# EAGLE schematic RFM69HCW_BREAKOUT (EAGLE 7.7.0)
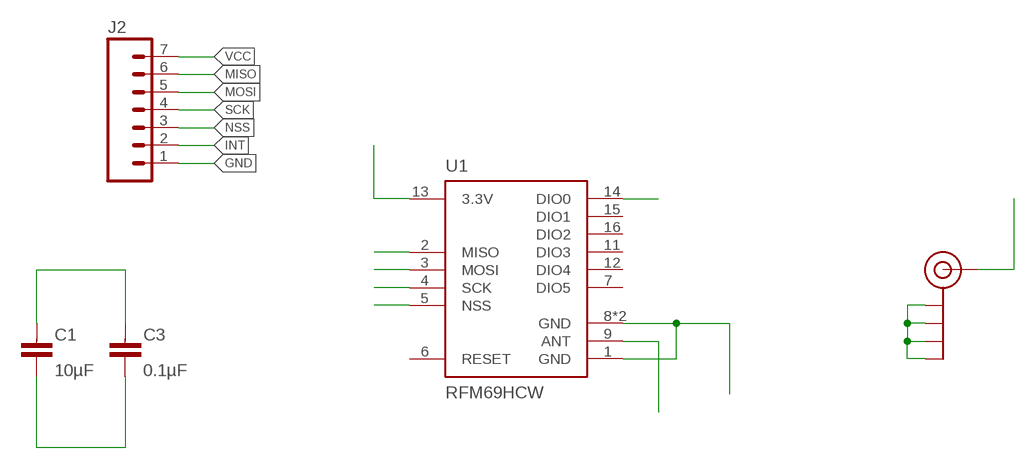
[diagram p0: schematic, sheet 1]

## Parts
C1  10µF  CAPACITOR0805-N  [C0805-N]
C3  0.1µF  CAPACITOR0603-N  [C0603-N]
J2  M07  [1X07]
J$1  SMA_EDGE  [SMA-EDGE]
U1  RFM69HCW  [RFM69HCW-XXXS2]

## Nets
ANT: J$1.SIG(SIGNAL) U1.9(ANT)
GND: C1.2 C3.2 J2.1 J$1.GND@0(GND) J$1.GND@1(GND) J$1.GND@2(GND) J$1.GND@3(GND) U1.1(GND) U1.8(GND) U1.10(GND)
INT: J2.2 U1.14(DIO0)
MISO: J2.6 U1.2(MISO)
MOSI: J2.5 U1.3(MOSI)
NSS: J2.3 U1.5(NSS)
SCK: J2.4 U1.4(SCK)
VCC: C1.1 C3.1 J2.7 U1.13(3.3V)
Unconnected: U1.6(RESET) U1.7(DIO5) U1.11(DIO3) U1.12(DIO4) U1.15(DIO1) U1.16(DIO2)

## Library data of the parts
C1 C3 = passives-7351:CAPACITOR
J2 = SparkFun-Connectors:M07: Header 7 Standard 7-pin 0.1" header. Use with straight break away headers (SKU : PRT-00116), right angle break away headers (PRT-00553), swiss pins (PRT-00743), machine pins (PRT-00117), and female headers (PRT-00115). NOTES ON THE VARIANTS LOCK and LOCK_LONGPADS... This footprint was designed to help hold the alignment of a through-hole component (i.e. 7-pin header) while soldering it into place. You may notice that each hole has been shifted either up or down by 0.005 of an inch from it's more standard position (which is usually a perfectly straight line). This slight alteration caused the pins (the squares in the middle) to touch the edges of the holes. Because they are alternating, it causes a "brace" to hold the header in place. 0.005 has proven to be the perfect amount of "off-center" position when using our standard breakaway headers. Although looks a little odd when you look at the bare footprint, once you have a header in there, the alteration is very hard to notice. Also, if you push a header all the way into place, it is covered up entirely on the bottom side. This idea of altering the position of holes to aid alignment will be further integrated into the Sparkfun Library for other footprints. It can help hold any component with 3 or more connection pins.
J$1 = SparkFun-Connectors:SMA_EDGE: SMA Antenna Connector End launch SMA connector. The paste layer has been removed so that the connector can be hand soldered onto the board after reflow.
U1 = SparkFun-RF:RFM69H; PROD_ID: IC-11997, IC-12053